# Altium schematic sheet MCP73831 Li-Ion charge.SchDoc: Li-Ion charge
size A4; Date: 08.05.2016; Author: Pavel Nadein; DocumentName: Li-Ion charge
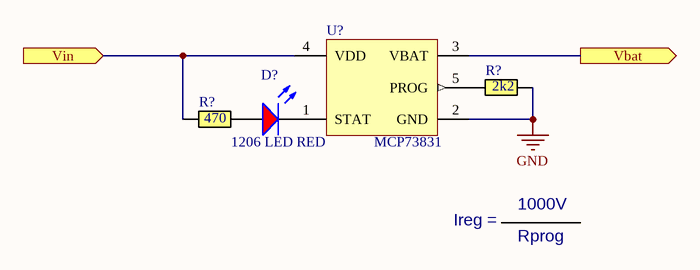
[diagram p0: MCP73831 Li-Ion charge.SchDoc]

## Parts
(Parts that share a designator on the sheet are numbered #1, #2 ... from top to bottom, then left to right.)
D?  1206 LED RED  [1206 LED RED]
R?#1  2k2  [RESC0603(1608)_N]
R?#2  470  [RESC0603(1608)_N]
U?  MCP73831  [SOT23-5]

## Ports
Vbat (out), Vin (in)

## Nets
GND: R?#1.2 U?.2(GND)
Vbat: U?.3(VBAT) ; port Vbat
Vin: R?#2.1 U?.4(VDD) ; port Vin
NetD?_A: D?.A R?#2.2
NetD?_K: D?.K U?.1(STAT)
NetR?#1_1: R?#1.1 U?.5(PROG)

## Notes on the sheet
- Ireg =
- 1000V
- Rprog

## Library data of the parts
R?#1 R?#2 = Resistor M: Resistor Medium Density
  R?#1: Value: 2k2
  R?#2: Value: 470
U? = MCP73831: Linear Charge Management Controller; Supply Voltage: 3.75 ~ 6V